# Altium project desk_supply.PrjPCB
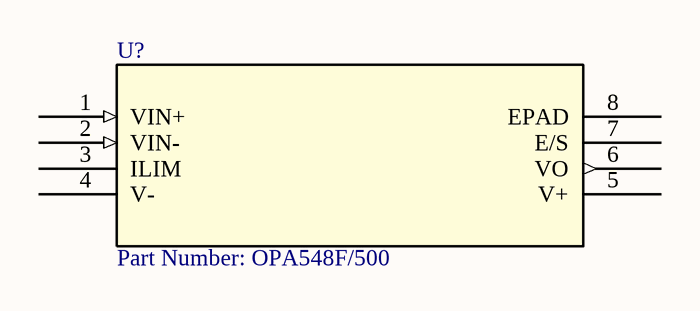
[diagram p0: output_stage.SchDoc]
1 sheet, 1 parts. Net scope: global (net labels, ports and power ports of the same name join across sheets).

## Sheet output_stage.SchDoc
size A4

### Parts
U?  Part Number: OPA548F/500  [KTW7]

### Nets

Not connected (* = marked no-connect by the designer): U? 1(VIN+) 2(VIN-) 3(ILIM) 4(V-) 5(V+) 6(VO) 7(E/S) 8(EPAD)

### Library data of the parts
U? = OPA548F/500: No Description Available; Manufacturer: Texas Instruments; Built_By: EMA_UL_Team; Vendor: Texas Instruments; Manufacturer_Part_Number: OPA548F/500; Copyright: Copyright (C) 2018 Accelerated Designs. All rights reserved; RefDes: RefDes; Type: DEV; Value: Value